# Altium schematic sheet Microcontroller.SchDoc
size A4; SheetNumber: 7; SheetTotal: 11
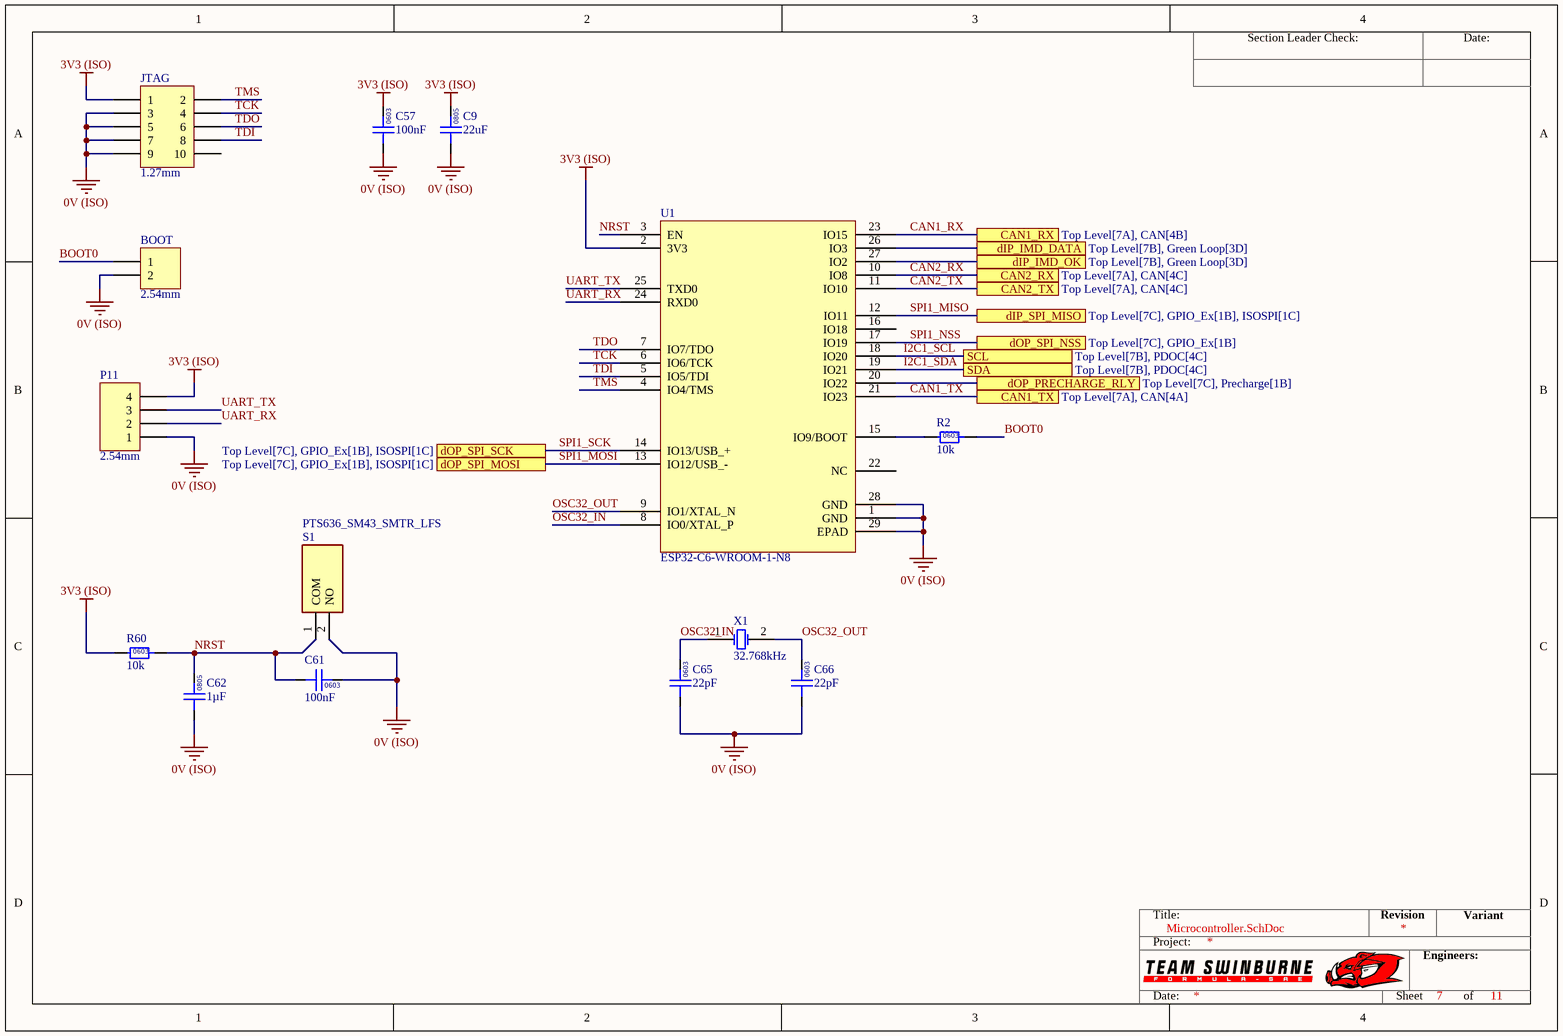
[diagram p0: Microcontroller.SchDoc]

## Parts
BOOT  2.54mm  [TH 2.54mm Header 1x2]
C9  22uF  [0805]
C57  100nF  [0603]
C61  100nF  [0603]
C62  1µF  [0805]
C65  22pF  [0603]
C66  22pF  [0603]
JTAG  1.27mm  [3221-10-0300-00]
P11  2.54mm  [TH 2.54mm Header 1x4]
R2  10k  [0603]
R60  10k  [0603]
S1  PTS636_SM43_SMTR_LFS  [PTS636SM43SMTRLFS]
U1  ESP32-C6-WROOM-1-N8  [ESP32-C6-WROOM-1-N8]
X1  32.768kHz  [EPSON 2-SMD]

## Ports
CAN1_RX (see Top Level[7A], CAN[4B]), CAN1_TX (see Top Level[7A], CAN[4A]), CAN2_RX (see Top Level[7A], CAN[4C]), CAN2_TX (see Top Level[7A], CAN[4C]), dIP_IMD_DATA (see Top Level[7B], Green Loop[3D]), dIP_IMD_OK (see Top Level[7B], Green Loop[3D]), dIP_SPI_MISO (see Top Level[7C], GPIO_Ex[1B], ISOSPI[1C]), dOP_PRECHARGE_RLY (see Top Level[7C], Precharge[1B]), dOP_SPI_MOSI (see Top Level[7C], GPIO_Ex[1B], ISOSPI[1C]), dOP_SPI_NSS (see Top Level[7C], GPIO_Ex[1B]), dOP_SPI_SCK (see Top Level[7C], GPIO_Ex[1B], ISOSPI[1C]), SCL (see Top Level[7B], PDOC[4C]), SDA (see Top Level[7B], PDOC[4C])

## Nets
0V (ISO): BOOT.2 C9.1 C57.1 C61.2 C62.1 C65.1 C66.1 JTAG.3 JTAG.5 JTAG.7 JTAG.9 P11.1 S1.2(NO) U1.1(GND) U1.28(GND) U1.29(EPAD)
3V3 (ISO): C9.2 C57.2 JTAG.1 P11.4 R60.1 U1.2(3V3)
BOOT0: BOOT.1 R2.2
CAN1_RX: U1.23(IO15) ; port CAN1_RX
CAN1_TX: U1.21(IO23) ; port CAN1_TX
CAN2_RX: U1.10(IO8) ; port CAN2_RX
CAN2_TX: U1.11(IO10) ; port CAN2_TX
dIP_IMD_DATA: U1.26(IO3) ; port dIP_IMD_DATA
dIP_IMD_OK: U1.27(IO2) ; port dIP_IMD_OK
dOP_PRECHARGE_RLY: U1.20(IO22) ; port dOP_PRECHARGE_RLY
I2C1_SCL: U1.18(IO20) ; port SCL
I2C1_SDA: U1.19(IO21) ; port SDA
NRST: C61.1 C62.2 R60.2 S1.1(COM) U1.3(EN)
OSC32_IN: C65.2 U1.8(IO0/XTAL_P) X1.1(OSC1)
OSC32_OUT: C66.2 U1.9(IO1/XTAL_N) X1.2(OSC2)
SPI1_MISO: U1.12(IO11) ; port dIP_SPI_MISO
SPI1_MOSI: U1.13(IO12/USB_-) ; port dOP_SPI_MOSI
SPI1_NSS: U1.17(IO19) ; port dOP_SPI_NSS
SPI1_SCK: U1.14(IO13/USB_+) ; port dOP_SPI_SCK
TCK: JTAG.4 U1.6(IO6/TCK)
TDI: JTAG.8 U1.5(IO5/TDI)
TDO: JTAG.6 U1.7(IO7/TDO)
TMS: JTAG.2 U1.4(IO4/TMS)
UART_RX: P11.2 U1.24(RXD0)
UART_TX: P11.3 U1.25(TXD0)
NetR2_1: R2.1 U1.15(IO9/BOOT)

Not connected (* = marked no-connect by the designer): JTAG 10; U1 16(IO18) 22(NC)

## Notes on the sheet
- Section Leader Check:
- Date:
- Title:
- Revision
- Variant
- Project:
- Engineers:
- Sheet
- of
- (in symbol GCM21BR71H105KA03L) 0805
- (in symbol GCM188L81H104KA57D) 0603
- (in symbol GRM21BR61A226ME51L) 0805
- (in symbol GRM0335C1H220JA01D) 0603
- (in symbol RC0603FR-0710KL) 0603

## Library data of the parts
BOOT = TH 2.54mm Header 1x2: Positions: 2; Angle: 0; Flange: No; Contact: NA; Part Number: TH 2.54mm Header 1x2; Pitch: 2.54mm; Row Spacing: 2.54mm
C9 = GRM21BR61A226ME51L: Manufacturer: muRata; Rated Voltage: 50V; Tolerance: 20%; Material: MLCC; Temperature Rating: X5R; Part Number: GRM21BR61A226ME51L; Value: 22uF; Digikey Part Number: 490-10511-1-ND
C57 C61 = GCM188L81H104KA57D: Manufacturer: muRata; Rated Voltage: 50V; Tolerance: ±10%; Material: MLCC; Temperature Rating: X8L; Part Number: GCM188L81H104KA57D; Value: 100nF; Digikey Part Number: 490-6049-1-ND
C62 = GCM21BR71H105KA03L: Manufacturer: muRata; Rated Voltage: 50V; Tolerance: ±10%; Material: MLCC; Temperature Rating: X7R; Part Number: GCM21BR71H105KA03L; Value: 1µF; Digikey Part Number: 490-10675-1-ND
C65 C66 = GRM0335C1H220JA01D: Manufacturer: Murata Electronics; Rated Voltage: 50V; Tolerance: ±5%; Material: MLCC; Temperature Rating: C0G, NP0; Part Number: GRM0335C1H220JA01D; Value: 22pF; Digikey Part Number: 490-6123-1-ND
JTAG = SMD 1.27mm Header 2x5 (3221-10-0300-00): Positions: 10; Angle: 0; Flange: No; Contact: NA; Part Number: SMD 1.27mm Header 2x5 (3221-10-0300-00); Pitch: 1.27mm; Row Spacing: 1.27mm
P11 = TH 2.54mm Header 1x4: Positions: 4; Angle: 0; Flange: No; Contact: NA; Part Number: TH 2.54mm Header 1x4; Pitch: 2.54mm; Row Spacing: 2.54mm
R2 R60 = RC0603FR-0710KL: Manufacturer: YAGEO; Tolerance: 0.01; Rated Power: 0.1W; Part Number: RC0603FR-0710KL; Value: 10k; Material: FR-07; Digikey Part Number: 311-10.0KHRCT-ND
S1 = PTS636_SM43_SMTR_LFS: Switch; Manufacturer_Name: C & K COMPONENTS; Manufacturer_Part_Number: PTS636 SM43 SMTR LFS; Datasheet Link: https://componentsearchengine.com/Datasheets/1/PTS636 SM43 SMTR LFS.pdf; Height: 4.5mm; Mouser Part Number: 611-PTS636SM43SMTRLF; Mouser Price/Stock: https://www.mouser.co.uk/ProductDetail/CK/PTS636-SM43-SMTR-LFS?qs=vLWxofP3U2xu5raMGkTmHg%3D%3D; Arrow Part Number: PTS636 SM43 SMTR LFS; Arrow Price/Stock: https://www.arrow.com/en/products/pts636-sm43-smtr-lfs/ck
U1 = ESP32-C6-WROOM-1-N8: RF TXRX MOD BT WIFI PCB TH SMD; Manufacturer: Espressif; Complex IC: 1; Part Number: ESP32-C6-WROOM-1-N8
X1 = FC-135 32.7680KA-A5: Manufacturer: EPSON; Load Capacitance: 12.5pF; ESR: 70k; Part Number: FC-135 32.7680KA-A5; Value: 32.768kHz; Digikey Part Number: SER4103TR-ND; Digikey Link: https://www.digikey.com/product-detail/en/epson/FC-135-32.7680KA-A5/SER4103TR-ND/5259895